# Altium schematic sheet ESP32.SchDoc: ESP32 & CH340C
size A4; SheetNumber: 3; SheetTotal: 3
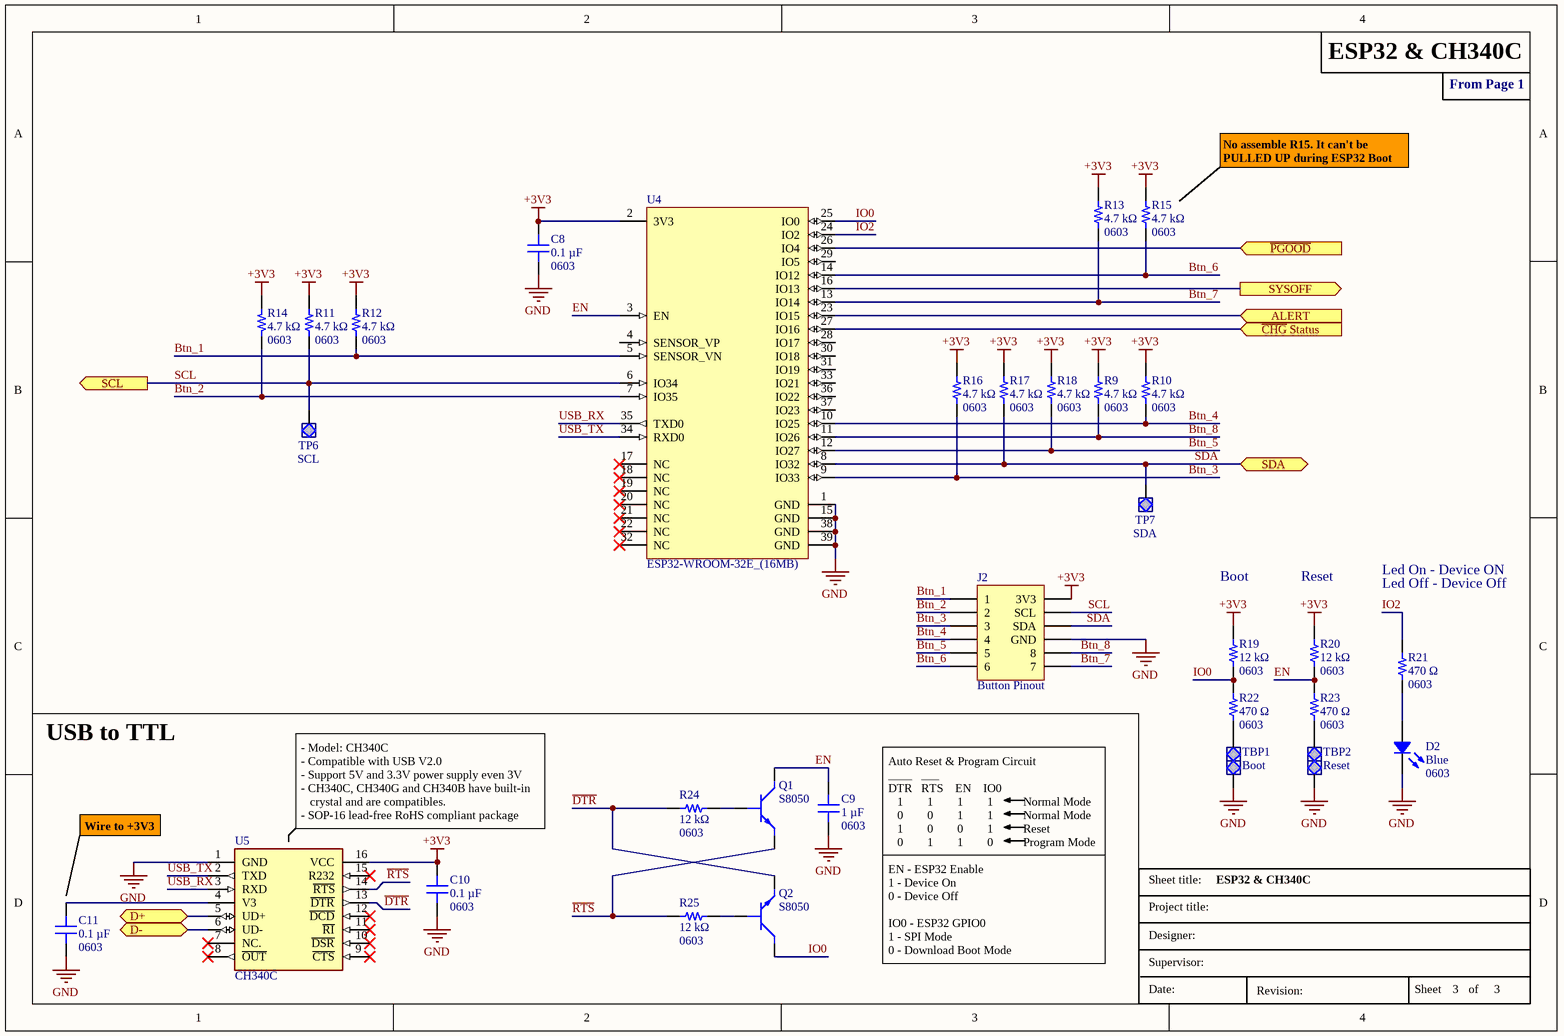
[diagram p0: ESP32.SchDoc]

## Parts
C8  Device Package: 0603  [CAP 0603_1608]  (hidden comment: 0.1 µF)
C9  Device Package: 0603  [CAP 0603_1608]  (hidden comment: 1 µF)
C10  Device Package: 0603  [CAP 0603_1608]  (hidden comment: 0.1 µF)
C11  Device Package: 0603  [CAP 0603_1608]  (hidden comment: 0.1 µF)
D2  Blue  Size: 0603  [LED 0603_1608 BLUE]
J2  Button Pinout  [PINOUT]
Q1  S8050  [SOT95P240X115-3N]
Q2  S8050  [SOT95P240X115-3N]
R9  Device Package: 0603  [RES 0603_1608]  (hidden comment: 4.7 kΩ)
R10  Device Package: 0603  [RES 0603_1608]  (hidden comment: 4.7 kΩ)
R11  Device Package: 0603  [RES 0603_1608]  (hidden comment: 4.7 kΩ)
R12  Device Package: 0603  [RES 0603_1608]  (hidden comment: 4.7 kΩ)
R13  Device Package: 0603  [RES 0603_1608]  (hidden comment: 4.7 kΩ)
R14  Device Package: 0603  [RES 0603_1608]  (hidden comment: 4.7 kΩ)
R15  Device Package: 0603  [RES 0603_1608]  (hidden comment: 4.7 kΩ)
R16  Device Package: 0603  [RES 0603_1608]  (hidden comment: 4.7 kΩ)
R17  Device Package: 0603  [RES 0603_1608]  (hidden comment: 4.7 kΩ)
R18  Device Package: 0603  [RES 0603_1608]  (hidden comment: 4.7 kΩ)
R19  12 kΩ  Size: 0603  [RES 0603_1608]
R20  12 kΩ  Size: 0603  [RES 0603_1608]
R21  470 Ω  Size: 0603  [RES 0603_1608]
R22  470 Ω  Size: 0603  [RES 0603_1608]
R23  470 Ω  Size: 0603  [RES 0603_1608]
R24  12 kΩ  Size: 0603  [RES 0603_1608]
R25  12 kΩ  Size: 0603  [RES 0603_1608]
TBP1  Boot  [Tweezer-bridgeable Pads]  (no BOM)
TBP2  Reset  [Tweezer-bridgeable Pads]  (no BOM)
TP6  SCL  [TestPoint]  (no BOM)
TP7  SDA  [TestPoint]  (no BOM)
U4  ESP32-WROOM-32E_(16MB)  [XCVR_ESP32-WROOM-32E_(16MB)]
U5  CH340C  [SOIC127P600X180-16N]

## Blocks framed on the sheet
USB to TTL: C9-C11 Q1 Q2 R24 R25 U5

## Ports
ALERT (in, see Main[3B], USB_&_Power[2C]), D+ (bidir, see Main[3C], USB_&_Power[2B]), D- (bidir, see Main[3C], USB_&_Power[2C]), SCL (out, see Main[3B], USB_&_Power[2D]), SDA (bidir, see Main[3B], USB_&_Power[2D]), SYSOFF (out, see Main[3B], USB_&_Power[2B]), ~{CHG} Status (in, see Main[3B]), ~{PGOOD} (in, see Main[3B], USB_&_Power[4A])

## Nets
+3V3: C8.2 C10.2 J2.12(3V3) R9.2 R10.2 R11.2 R12.2 R13.2 R14.2 R15.2 R16.2 R17.2 R18.2 R19.1 R20.1 U4.2(3V3) U5.16(VCC)
GND: C8.1 C9.1 C10.1 C11.1 D2.2 J2.9(GND) TBP1.2 TBP2.2 U4.1(GND) U4.15(GND) U4.38(GND) U4.39(GND) U5.1(GND)
~{CHG} Status: U4.27(IO16) ; port ~{CHG} Status
~{PGOOD}: U4.26(IO4) ; port ~{PGOOD}
ALERT: U4.23(IO15) ; port ALERT
Btn_1: J2.1 R12.1 U4.5(SENSOR_VN)
Btn_2: J2.2 R14.1 U4.7(IO35)
Btn_3: J2.3 R16.1 U4.9(IO33)
Btn_4: J2.4 R10.1 U4.10(IO25)
Btn_5: J2.5 R18.1 U4.12(IO27)
Btn_6: J2.6 R15.1 U4.14(IO12)
Btn_7: J2.7 R13.1 U4.13(IO14)
Btn_8: J2.8 R9.1 U4.11(IO26)
D+: U5.5(UD+) ; port D+
D-: U5.6(UD-) ; port D-
~{DTR}: Q2.3(E) R24.1 U5.13(~{DTR})
EN: C9.2 Q1.2(C) R20.2 R23.1 U4.3(EN)
IO0: Q2.2(C) R19.2 R22.1 U4.25(IO0)
IO2: R21.1 U4.24(IO2)
~{RTS}: Q1.3(E) R25.1 U5.14(~{RTS})
SCL: J2.11(SCL) R11.1 TP6.1 U4.6(IO34) ; port SCL
SDA: J2.10(SDA) R17.1 TP7.1 U4.8(IO32) ; port SDA
SYSOFF: U4.16(IO13) ; port SYSOFF
USB_RX: U4.35(TXD0) U5.3(RXD)
USB_TX: U4.34(RXD0) U5.2(TXD)
NetC11_2: C11.2 U5.4(V3)
NetD2_1: D2.1 R21.2
NetQ1_1: Q1.1(B) R24.2
NetQ2_1: Q2.1(B) R25.2
NetR22_2: R22.2 TBP1.1
NetR23_2: R23.2 TBP2.1

Not connected (* = marked no-connect by the designer): U4 4(SENSOR_VP) 17(NC)* 18(NC)* 19(NC)* 20(NC)* 21(NC)* 22(NC)* 28(IO17) 29(IO5) 30(IO18) 31(IO19) 32(NC)* 33(IO21) 36(IO22) 37(IO23); U5 7(NC.)* 8(~{OUT})* 9(~{CTS})* 10(~{DSR})* 11(~{RI})* 12(~{DCD})* 15(R232)*

## Notes on the sheet
- From Page 1
- No assemble R15. It can't be PULLED UP during ESP32 Boot
- Boot
- Reset
- Led On - Device ON
- Led Off - Device Off
- Wire to +3V3
- - Model: CH340C
  - Compatible with USB V2.0
  - Support 5V and 3.3V power supply even 3V
  - CH340C, CH340G and CH340B have built-in
  crystal and are compatibles.
  - SOP-16 lead-free RoHS compliant package
- Auto Reset & Program Circuit
  ____   ___
  DTR   RTS    EN    IO0
  1        1        1        1	         Normal Mode
  0        0        1        1          Normal Mode
  1        0        0        1          Reset
  0        1        1        0          Program Mode
- EN - ESP32 Enable
  1 - Device On
  0 - Device Off
  IO0 - ESP32 GPIO0
  1 - SPI Mode
  0 - Download Boot Mode
- Sheet title:
- Project title:
- Designer:
- Supervisor:
- Date:
- Revision:
- Sheet
- of

## Library data of the parts
C8 C10 C11 = 100X14W104MV4T: CAP CER 0.1UF 10V X7R 0603; manufacturer: Johanson Dielectrics Inc.; Tolerance: ±20%; Part Number: 100X14W104MV4T; Applications: Bypass, Decoupling; Capacitance: 0.1 µF; componentlink1description: Datasheet; componentlink1url: https://www.johansondielectrics.com/downloads/x2y-filter-and-decoupling-capacitors.pdf; componentlink2description: DigiKey Link; componentlink2url: https://www.digikey.com/en/products/detail/johanson-dielectrics-inc/100X14W104MV4T/1655914; Features: Low ESL (X2Y); lastupdated: 16/06/2023 19:15:23; Lifecycle Status: Active; Minimum Order: 1; Mounting Type: Surface Mount, MLCC; Operating Temperature: -55°C ~ 125°C; Package / Case: 0603 (1608 Metric); packaging: TapeAndReel; partid: 2680; Part Status: Active; price: 0.08; series: X2Y®; Size / Dimension: 0.064" L x 0.035" W (1.63mm x 0.89mm); Supplier 1: DigiKey; Supplier Part Number 1: 709-1101-1-ND; Temperature Coefficient: X7R; Thickness (Max): 0.026" (0.66mm); Voltage - Rated: 10V; Value: 0.1 µF
C9 = 0603B105K250CT: CAP CER 1UF 25V X7R 0603; manufacturer: Walsin Technology Corporation; Tolerance: ±10%; Part Number: 0603B105K250CT; Applications: General Purpose; Capacitance: 1 µF; componentlink1description: Datasheet; componentlink1url: https://www.passivecomponent.com/wp-content/uploads/datasheet/WTC_MLCC_General_Purpose.pdf; componentlink2description: DigiKey Link; componentlink2url: https://www.digikey.com/en/products/detail/walsin-technology-corporation/0603B105K250CT/14836817; lastupdated: 16/06/2023 19:14:03; Lifecycle Status: Active; Minimum Order: 1; Mounting Type: Surface Mount, MLCC; Operating Temperature: -55°C ~ 125°C; Package / Case: 0603 (1608 Metric); packaging: TapeAndReel; partid: 41189; Part Status: Active; price: 0.03; series: -; Size / Dimension: 0.063" L x 0.031" W (1.60mm x 0.80mm); Supplier 1: DigiKey; Supplier Part Number 1: 1292-0603B105K250CT-ND; Temperature Coefficient: X7R; Thickness (Max): 0.037" (0.95mm); Voltage - Rated: 25V; Value: 1 µF
D2 = LED: LED BLUE 0603 SMD; Part Number: VLMB1300-GS08; Manufacturer: Vishay Semiconductor Opto Division; Configuration: Standard; Current - Test: 20mA; Lens Color: 1.00mm; Lens Size: 1.10mm x 0.80mm; Lens Style: Rectangle with Flat Top; Millicandela Rating: 104mcd; Viewing Angle: 130°; Voltage - Forward (Vf) (Typ): 3.3V; Wavelength - Dominant: 470nm; Wavelength - Peak: 468nm; Color: Blue; ComponentLink1Description: Datasheet; ComponentLink1URL: http://www.vishay.com/docs/82437/vlmo1300.pdf; ComponentLink2Description: DigiKey Link; ComponentLink2URL: http://digikey.com/product-detail/en/vishay-semiconductor-opto-division/VLMB1300-GS08/VLMB1300-GS08CT-ND/3025485; Device Package: 0603 (1608 Metric); Height (Max): 1.00mm; LastUpdated: 09/02/2020 01:20:26; Lifecycle Status: Active; Minimum Order: 1; Mounting Type: Surface Mount; Package / Case: 0603 (1608 Metric); Packaging: TapeAndReel; PartId: 785; Part Status: Active; Price: 0.08; Series: CHIPLED; Size / Dimension: 1.60mm L x 0.80mm W; Supplier 1: DigiKey; Supplier Part Number 1: VLMB1300-GS08CT-ND; Supplier Device Package: 0603; Value: Blue; Category: LED
Q1 Q2 = S8050: Transistor; Manufacturer_Name: Yenji Elec; Datasheet Link: https://datasheet.lcsc.com/szlcsc/Yenji-Elec-S8050_C139514.pdf; Height: 1.15mm; Manufacturer_Part_Number: S8050; Category: BJT Transistor
R9-R18 = ERA-3AEB472V: RES SMD 4.7K OHM 0.1% 1/10W 0603; Manufacturer: Panasonic Electronic Components; Power (Watts): 0.1W, 1/10W; Resistance: 4.7 kOhms; Temperature Coefficient: ±25ppm/°C; Part Number: ERA-3AEB472V; ComponentLink1Description: Datasheet; ComponentLink1URL: https://industrial.panasonic.com/cdbs/www-data/pdf/RDM0000/AOA0000C307.pdf; ComponentLink2Description: DigiKey Link; ComponentLink2URL: https://www.digikey.com/en/products/detail/panasonic-electronic-components/ERA-3AEB472V/1465870; Composition: Thin Film; Features: Automotive AEC-Q200; Height - Seated (Max): 0.022" (0.55mm); LastUpdated: 02/08/2023 19:13:59; Lifecycle Status: Active; Minimum Order: 1; Number of Terminations: 2; Operating Temperature: -55°C ~ 155°C; Package / Case: 0603 (1608 Metric); Packaging: TapeAndReel; PartId: 5519; Part Status: Active; Price: 0.03; Ratings: AEC-Q200; Series: ERA-3A; Size / Dimension: 0.063" L x 0.031" W (1.60mm x 0.80mm); Supplier 1: DigiKey; Supplier Part Number 1: P4.7KDBCT-ND; Supplier Device Package: 0603; Tolerance: ±0.1%; Value: 4.7 kΩ
R19 R20 R24 R25 = RMCF0603JT12K0: RES 12K OHM 5% 1/10W 0603; Manufacturer: Stackpole Electronics Inc; Power (Watts): 0.1W, 1/10W; Resistance: 12 kOhms; Temperature Coefficient: ±200ppm/°C; Part Number: RMCF0603JT12K0; ComponentLink1Description: Datasheet; ComponentLink1URL: https://www.seielect.com/catalog/sei-rmcf_rmcp.pdf; ComponentLink2Description: DigiKey Link; ComponentLink2URL: http://digikey.com/product-detail/en/stackpole-electronics-inc/RMCF0603JT12K0/RMCF0603JT12K0CT-ND/1943192; Composition: Thick Film; Device Package: 0603 (1608 Metric); Features: Automotive AEC-Q200; Height - Seated (Max): 0.022" (0.55mm); LastUpdated: 09/02/2020 01:10:24; Lifecycle Status: Active; Minimum Order: 1; Number of Terminations: 2; Operating Temperature: -55°C ~ 155°C; Package / Case: 0603 (1608 Metric); Packaging: CutTape; PartId: 5166; Part Status: Active; Price: 0.10; Ratings: AEC-Q200; Series: RMCF; Size / Dimension: 0.061" L x 0.031" W (1.55mm x 0.80mm); Supplier 1: DigiKey; Supplier Part Number 1: RMCF0603JT12K0CT-ND; Supplier Device Package: 0603; Tolerance: ±5%; Value: 12 kΩ; Category: Res
R21-R23 = RMCF0603JT470R: RES 470 OHM 5% 1/10W 0603; Manufacturer: Stackpole Electronics Inc; Power (Watts): 0.1W, 1/10W; Resistance: 470 Ohms; Temperature Coefficient: ±200ppm/°C; Part Number: RMCF0603JT470R; ComponentLink1Description: Datasheet; ComponentLink1URL: https://www.seielect.com/catalog/sei-rmcf_rmcp.pdf; ComponentLink2Description: DigiKey Link; ComponentLink2URL: http://digikey.com/product-detail/en/stackpole-electronics-inc/RMCF0603JT470R/RMCF0603JT470RCT-ND/1943166; Composition: Thick Film; Device Package: 0603 (1608 Metric); Features: Automotive AEC-Q200; Height - Seated (Max): 0.022" (0.55mm); LastUpdated: 09/02/2020 01:10:23; Lifecycle Status: Active; Minimum Order: 1; Number of Terminations: 2; Operating Temperature: -55°C ~ 155°C; Package / Case: 0603 (1608 Metric); Packaging: CutTape; PartId: 5857; Part Status: Active; Price: 0.10; Ratings: AEC-Q200; Series: RMCF; Size / Dimension: 0.061" L x 0.031" W (1.55mm x 0.80mm); Supplier 1: DigiKey; Supplier Part Number 1: RMCF0603JT470RCT-ND; Supplier Device Package: 0603; Tolerance: ±5%; Value: 470 Ω; Category: Res
TBP1 TBP2 = Tweezer-Bridgeabled Pads
TP6 TP7 = TestPoint
U4 = ESP32-WROOM-32E_(16MB): Bluetooth, WiFi 802.11b/g/n, Bluetooth v4.2 +EDR, Class 1, 2 and 3 Transceiver Module 2.4GHz ~ 2.5GHz Integrated, Trace Surface Mount; MP: ESP32-WROOM-32E (16MB); MF: Espressif Systems; Price: None; Availability: Not in stock; Package: None; Value: *; SnapEDA_Link: https://www.snapeda.com/parts/ESP32-WROOM-32E%20(16MB)/Espressif+Systems/view-part/?ref=snap; Check_prices: https://www.snapeda.com/parts/ESP32-WROOM-32E%20(16MB)/Espressif+Systems/view-part/?ref=eda
U5 = CH340C: USB to serial chip CH340; MF: WCH; Package: None; Availability: Not in stock; SnapEDA_Link: https://www.snapeda.com/parts/CH340C/WCH/view-part/?ref=snap; MP: CH340C; Check_prices: https://www.snapeda.com/parts/CH340C/WCH/view-part/?ref=eda; Value: *; Price: None; Category: Chip